# EAGLE design agrosavia_pcb (EAGLE 9.6.2)
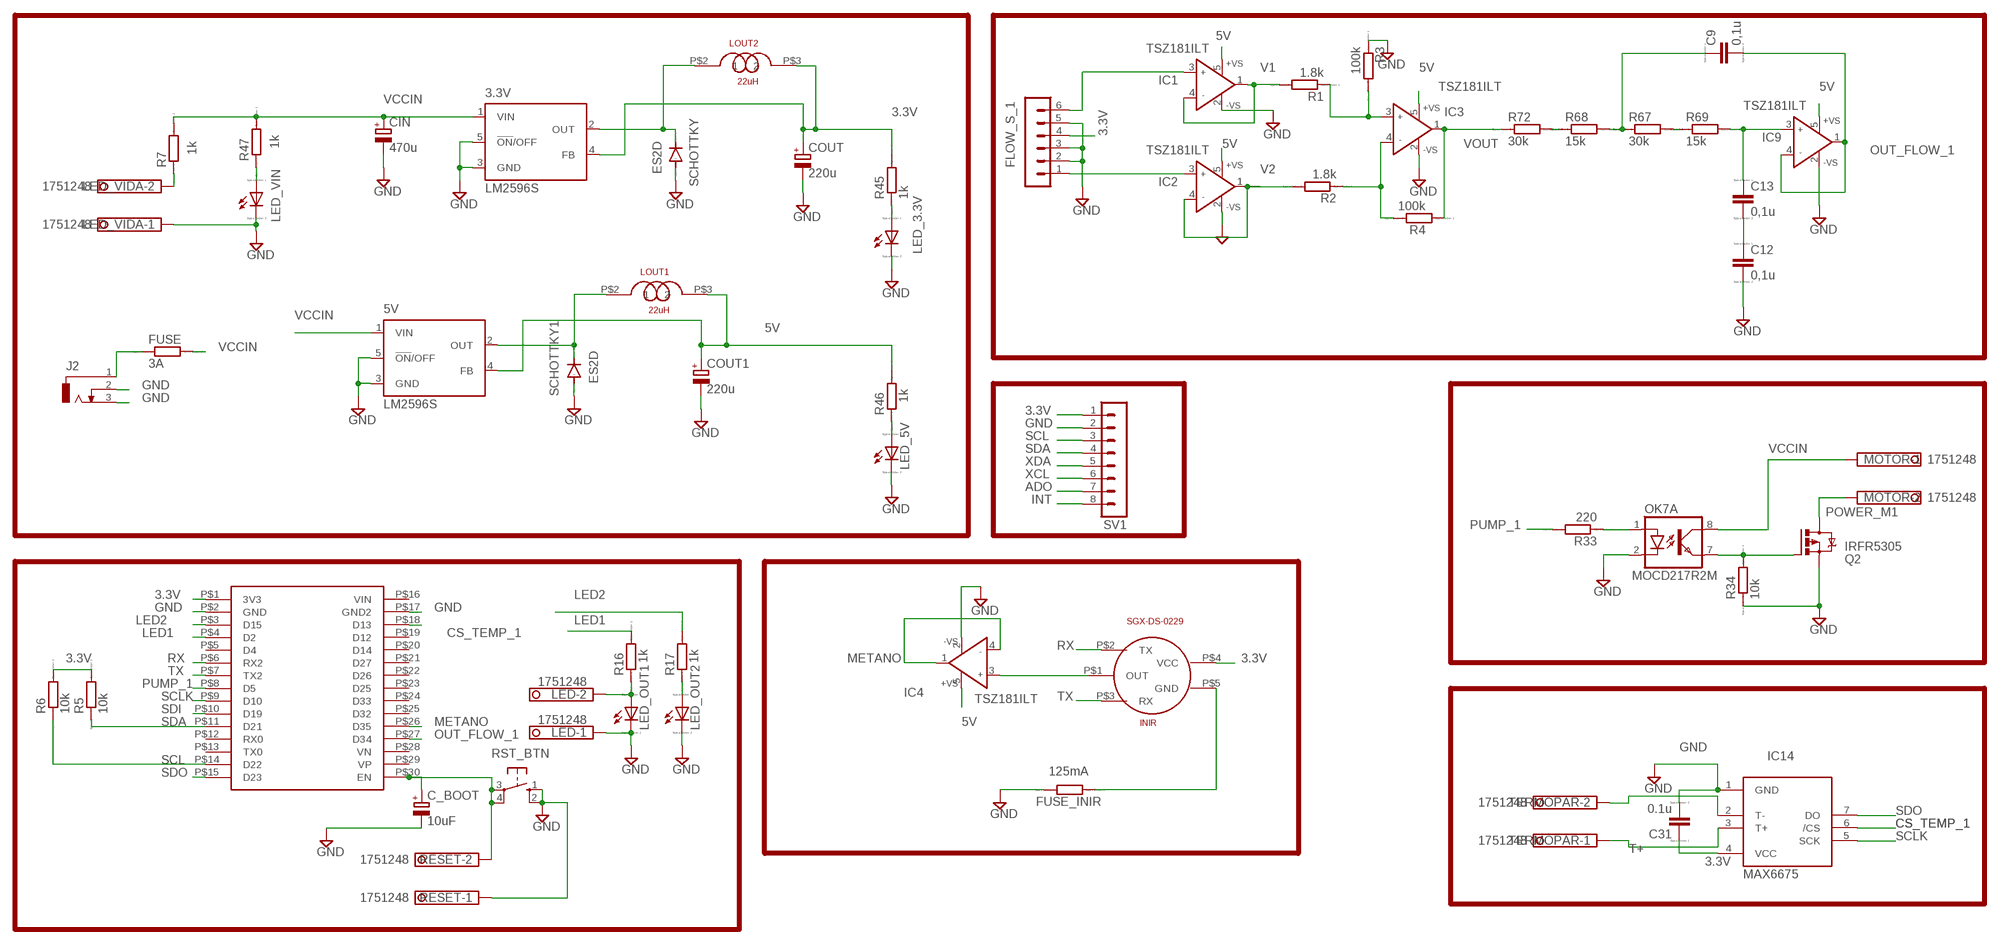
[diagram p0: schematic, sheet 1]

## Parts
3.3V  LM2596S  [TO263-5]
5V  LM2596S  [TO263-5]
C9  0,1u  C  [C0805]
C12  0,1u  C  [C0805]
C13  0,1u  C  [C0805]
C31  0.1u  C  [C0805]
C_BOOT  10uF  CPOL-EUSANYO_SMD_B6  [SANYO-OSCON_SMD_B6]
CIN  470u  CPOL-EUSANYO_SMD_F12  [SANYO-OSCON_SMD_F12]
COUT  220u  CPOL-EUUD-10X10  [UD-10X10_NICHICON]
COUT1  220u  CPOL-EUUD-10X10  [UD-10X10_NICHICON]
ESP32DEVKITV1  ESP32  [ESP32]
FLOW_S_1  MA06-1  [MA06-1]
FUSE  3A  RR1206  [R1206]
FUSE_INIR  125mA  RR0402  [R0402]
IC1  TSZ181ILT  AD8001RT  [SOT23-5]
IC2  TSZ181ILT  AD8001RT  [SOT23-5]
IC3  TSZ181ILT  AD8001RT  [SOT23-5]
IC4  TSZ181ILT  AD8001RT  [SOT23-5]
IC9  TSZ181ILT  AD8001RT  [SOT23-5]
IC14  MAX6675  [SO08]
J2  DCJ0303  [DCJ0303]
LED  1751248  [1751248]
LED_3.3V  LED_E  [LED_1206]
LED_5V  LED_E  [LED_1206]
LED_OUT1  LED_E  [LED_1206]
LED_OUT2  LED_E  [LED_1206]
LED_VIDA  1751248  [1751248]
LED_VIN  LED_E  [LED_1206]
LOUT1  22uH  SRP1038A  [SRP1038A]
LOUT2  22uH  SRP1038A  [SRP1038A]
MOTOR  1751248  [1751248]
OK7  MOCD217R2M  ILD205  [SOIC08]
Q2  IRFR5305  [D-PAK_TO252AA]
R1  1.8k  R  [R0805]
R2  1.8k  R  [R0805]
R3  100k  R  [R0805]
R4  100k  R  [R0805]
R5  10k  RR1206  [R1206]
R6  10k  RR1206  [R1206]
R7  1k  R  [R0805]
R16  1k  R  [R0805]
R17  1k  R  [R0805]
R33  220  RR0603  [R0603]
R34  10k  RR1206  [R1206]
R45  1k  R  [R0805]
R46  1k  R  [R0805]
R47  1k  R  [R0805]
R67  30k  R  [R0805]
R68  15k  R  [R0805]
R69  15k  R  [R0805]
R72  30k  R  [R0805]
RESET  1751248  [1751248]
RST_BTN  10-XX  [B3F-10XX]
SCHOTTKY  ES2D  [SMB]
SCHOTTKY1  ES2D  [SMB]
SGX-DS-0229  INIR  [INIR]
SV1  MA08-1  [MA08-1]
TERMOPAR  1751248  [1751248]

## Nets
3.3V: 3.3V.4(FB) C31.1 COUT.+ ESP32DEVKITV1.P$1(3V3) FLOW_S_1.4 IC14.4(VCC) LOUT2.P$3 R5.2 R6.2 R45.2 SGX-DS-0229.P$4(VCC) SV1.1
5V: 5V.4(FB) COUT1.+ IC1.5(+VS) IC2.5(+VS) IC3.5(+VS) IC4.5(+VS) IC9.5(+VS) LOUT1.P$3 R46.2
ADO: SV1.7
CS_TEMP_1: ESP32DEVKITV1.P$18(D13) IC14.6(/CS)
GND: 3.3V.3(GND) 3.3V.5(!ON!/OFF) 5V.3(GND) 5V.5(!ON!/OFF) C12.2 C31.2 C_BOOT.- CIN.- COUT1.- COUT.- ESP32DEVKITV1.P$2(GND) ESP32DEVKITV1.P$17(GND2) FLOW_S_1.2 FLOW_S_1.3 FLOW_S_1.5 FUSE_INIR.2 IC1.2(-VS) IC2.2(-VS) IC3.2(-VS) IC4.2(-VS) IC9.2(-VS) IC14.1(GND) J2.2 J2.3 LED.1 LED_3.3V.C LED_5V.C LED_OUT1.C LED_OUT2.C LED_VIDA.1 LED_VIN.C OK7.2(A:C) Q2.3(S) R3.1 R34.1 RESET.1 RST_BTN.1(S) RST_BTN.2(S1) SCHOTTKY1.A SCHOTTKY.A SV1.2
INT: SV1.8
LED1: ESP32DEVKITV1.P$4(D2) R16.2
LED2: ESP32DEVKITV1.P$3(D15) R17.2
METANO: ESP32DEVKITV1.P$26(D35) IC4.1(OUT) IC4.4(IN-)
N$1: FLOW_S_1.1 IC2.3(IN+)
N$2: FLOW_S_1.6 IC1.3(IN+)
N$4: IC3.3(IN+) R1.1 R3.2
N$5: IC3.4(IN-) R2.1 R4.2
N$6: FUSE_INIR.1 SGX-DS-0229.P$5(GND)
N$7: C_BOOT.+ ESP32DEVKITV1.P$30(EN) RESET.2 RST_BTN.3(P) RST_BTN.4(P1)
N$8: IC4.3(IN+) SGX-DS-0229.P$1(OUT)
N$9: LED_VIDA.2 R7.1
N$15: LED.2 LED_OUT1.A R16.1
N$16: LED_OUT2.A R17.1
N$33: OK7.1(A:A) R33.1
N$37: OK7.7(A:EMIT) Q2.1(G) R34.2
N$43: 3.3V.2(OUT) LOUT2.P$2 SCHOTTKY.C
N$44: 5V.2(OUT) LOUT1.P$2 SCHOTTKY1.C
N$48: LED_3.3V.A R45.1
N$49: LED_VIN.A R47.1
N$50: LED_5V.A R46.1
N$59: IC14.2(T-) TERMOPAR.2
N$63: FUSE.1 J2.1
N$74: R68.1 R72.2
N$75: C9.1 R67.1 R68.2
N$76: R67.2 R69.1
N$77: C13.1 IC9.3(IN+) R69.2
N$78: C12.1 C13.2
OUT_FLOW_1: C9.2 ESP32DEVKITV1.P$27(D34) IC9.1(OUT) IC9.4(IN-)
POWER_M1: MOTOR.2 Q2.4(D)
PUMP_1: ESP32DEVKITV1.P$8(D5) R33.2
RX: ESP32DEVKITV1.P$6(RX2) SGX-DS-0229.P$2(TX)
SCL: ESP32DEVKITV1.P$14(D22) R6.1 SV1.3
SCLK: ESP32DEVKITV1.P$9(D10) IC14.5(SCK)
SDA: ESP32DEVKITV1.P$11(D21) R5.1 SV1.4
SDI: ESP32DEVKITV1.P$10(D19)
SDO: ESP32DEVKITV1.P$15(D23) IC14.7(DO)
T+: IC14.3(T+) TERMOPAR.1
TX: ESP32DEVKITV1.P$7(TX2) SGX-DS-0229.P$3(RX)
V1: IC1.1(OUT) IC1.4(IN-) R1.2
V2: IC2.1(OUT) IC2.4(IN-) R2.2
VCCIN: 3.3V.1(VIN) 5V.1(VIN) CIN.+ FUSE.2 MOTOR.1 OK7.8(A:COL) R7.2 R47.2
VOUT: IC3.1(OUT) R4.1 R72.1
XCL: SV1.6
XDA: SV1.5
Unconnected: ESP32DEVKITV1.P$5(D4) ESP32DEVKITV1.P$12(RX0) ESP32DEVKITV1.P$13(TX0) ESP32DEVKITV1.P$16(VIN) ESP32DEVKITV1.P$19(D12) ESP32DEVKITV1.P$20(D14) ESP32DEVKITV1.P$21(D27) ESP32DEVKITV1.P$22(D26) ESP32DEVKITV1.P$23(D25) ESP32DEVKITV1.P$24(D33) ESP32DEVKITV1.P$25(D32) ESP32DEVKITV1.P$28(VN) ESP32DEVKITV1.P$29(VP) OK7.3(B:A) OK7.4(B:C) OK7.5(B:EMIT) OK7.6(B:COL)

## Library data of the parts
3.3V 5V = national-semiconductor:LM2596: SIMPLE SWITCHER® Power Converter 150 kHz 3A Step-Down Voltage Regulator Source: http://www.national.com/ds/LM/LM2596.pdf; MF: NATIONAL SEMICONDUCTOR; MPN: LM2596S-ADJ/NOPB; OC_FARNELL: 9494367; OC_NEWARK: 41K3842
C9 C12 C13 C31 = eagle-ltspice:C: CAPACITOR, European symbol; SPICEMODEL: NONE; SPICEPREFIX: C
C_BOOT CIN COUT COUT1 = rcl:CPOL-EU: POLARIZED CAPACITOR, European symbol; SPICEPREFIX: C
ESP32DEVKITV1 = ESP32:ESP32
FLOW_S_1 = con-lstb:MA06-1: PIN HEADER; OC_FARNELL: unknown; OC_NEWARK: unknown
FUSE FUSE_INIR R1-R7 R16 R17 R33 R34 R45-R47 R67-R69 R72 = eagle-ltspice:R: RESISTOR, European symbol; SPICEMODEL: NONE; SPICEPREFIX: R
IC1-IC4 IC9 = analog-devices:AD8001: 800 MHz, 50 mW Current Feedback Amplifier Source: http://www.analog.com/static/imported-files/data_sheets/AD8001.pdf; MF: ALTERA CORPORATION; MPN: AD8001ARTZ-REEL7; OC_FARNELL: 1651271; OC_NEWARK: 59K6136
IC14 = MAX6675:MAX6675; AVAILABILITY: Unavailable; DESCRIPTION: IC THERMOCOUP TO DGTL 8-SOIC; MF: Maxim Integrated; MP: MAX6675; PACKAGE: SOIC-8 Maxim Integrated; PRICE: None
J2 = con-jack:DCJ0303: DC POWER JACK Source: DCJ0303.pdf; OC_FARNELL: unknown; OC_NEWARK: unknown
LED LED_VIDA MOTOR RESET TERMOPAR = con-phoenix-350:1751248: MKDS 1/ 2-3,5 Printklemme Nennstrom: 10 A Bemessungsspannung: 160 V Raster: 3,5 mm Polzahl: 2 Montageart: Löten Anschlussart: Schraubanschluss Anschlussrichtung vom Leiter zur Platine: 0° Source: http://eshop.phoenixcontact.com .. 1751248.pdf; OC_FARNELL: unknown; OC_NEWARK: unknown
LED_3.3V LED_5V LED_OUT1 LED_OUT2 LED_VIN = eagle-ltspice:LED_E: LED Source: http://www.osram.convergy.de Source: www.luxeon.com Source: www.kingbright.com; SPICEMODEL: NONE; SPICEPREFIX: D; SPICETYPE: diode
LOUT1 LOUT2 = SRP1038A:SRP1038A
OK7 = optocoupler:ILD2*: Siemens ILD205/206/207/211/213/217 DUAL PHOTOTRANSISTOR SMALL OUTLINE SURFACE MOUNT OPTOCOUPLER Source: 153385-da-01-en-Optocoupler_ILD205-T.pdf; MF: VISHAY/TELEFUNKEN; MPN: ILD205T; OC_FARNELL: 1469512; OC_NEWARK: 20H8678
Q2 = transistor-power:IRF?5305: HEXFET Power MOSFET Source: http://www.irf.com/product-info/datasheets/data/irfr5305pbf.pdf
RST_BTN = switch-omron:10-XX: OMRON SWITCH; MPN: B3F-1000; OC_FARNELL: 176432; OC_NEWARK: 36M3542
SCHOTTKY SCHOTTKY1 = diode:ES2D: DIODE super fast rectifier, 2 A
SGX-DS-0229 = INIR:INIR
SV1 = con-lstb:MA08-1: PIN HEADER; OC_FARNELL: unknown; OC_NEWARK: unknown

## Board
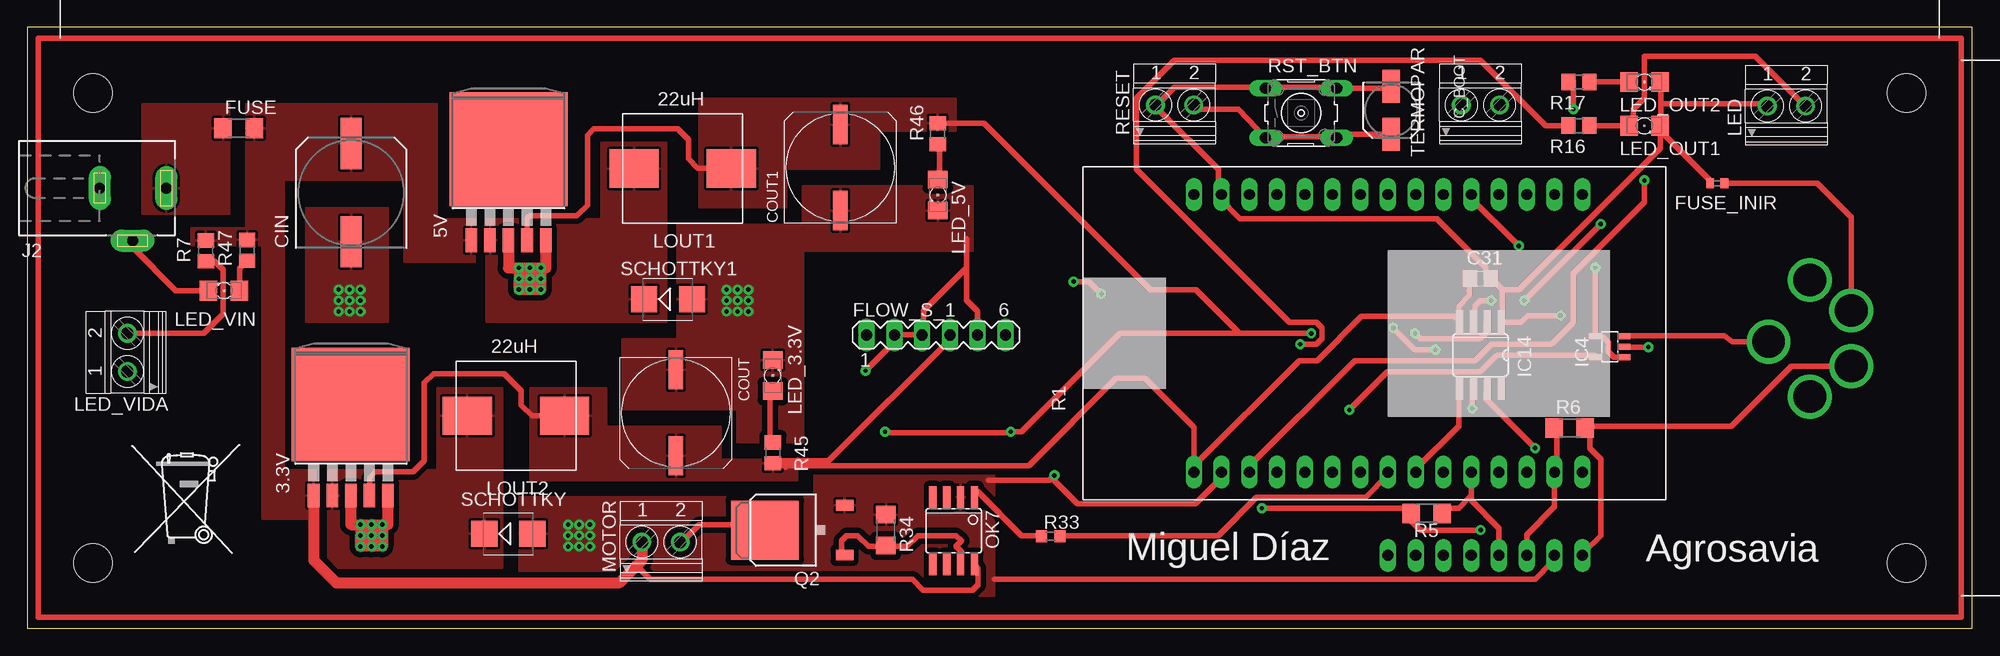
[diagram p1: board, top side]
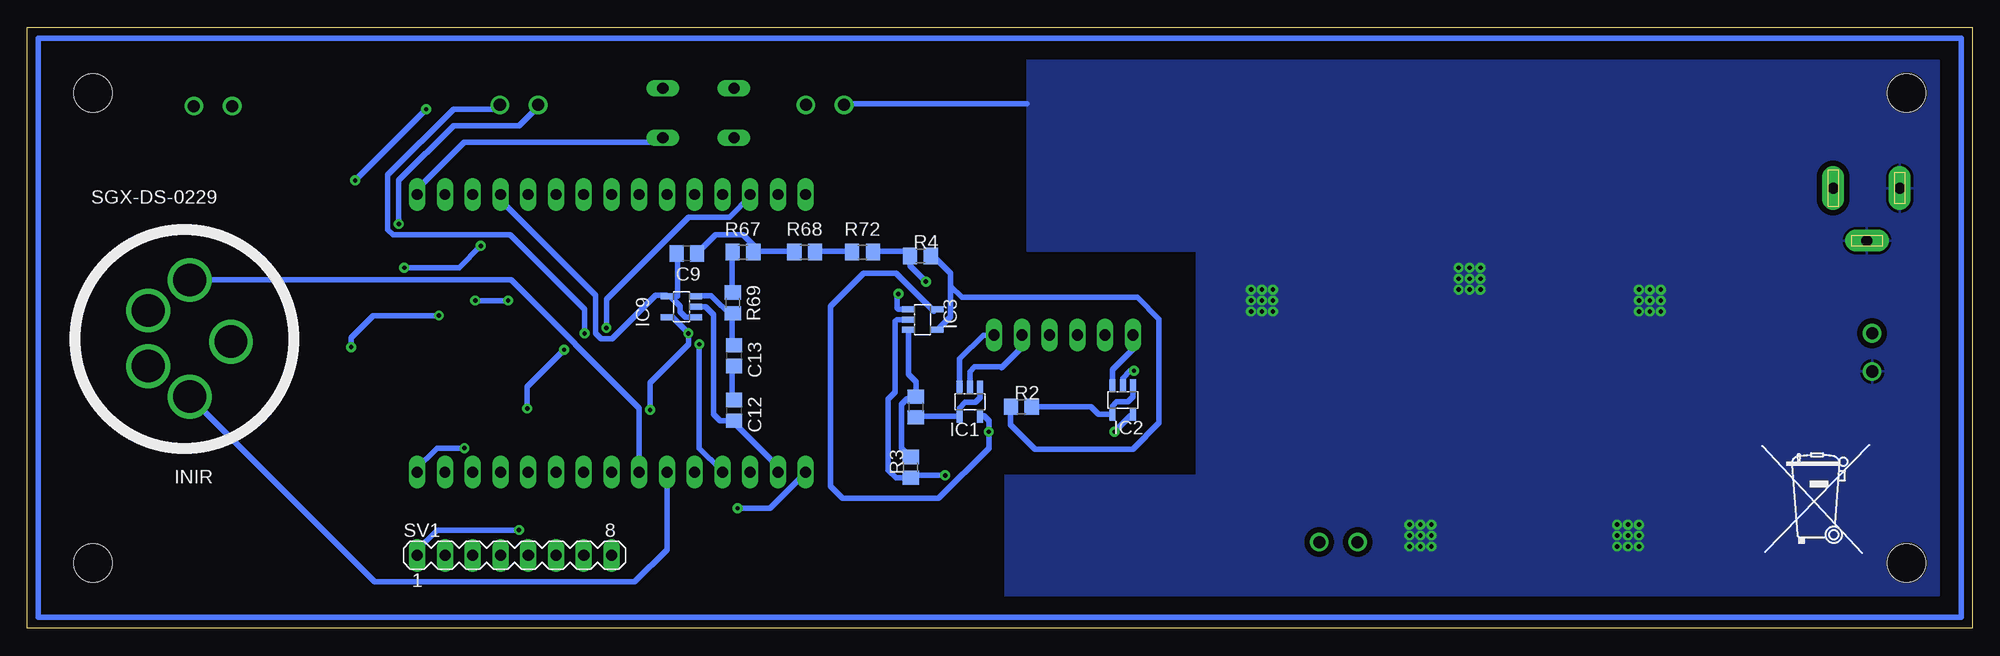
[diagram p2: board, bottom side, seen from below]

Size 178 x 55 mm. Coordinates in mm from the lower left corner, seen from the top.
Outline: 0,0 178,0 178,55 0,55 0,0
Copper layers (1*16): Top 0.035mm / dielectric 1.5mm / Bottom 0.035mm
Design rules "designrulesmicrocircuitos *": minimum track width 0.5mm, minimum drill 0.4mm, track to track 0.5mm, track to pad 0.3mm, pad to pad 0.3mm, via to via 0.3mm, smd to smd 4mil, copper to edge 5mil, drill to drill 6mil, minimum pad ring 0.25mm, minimum via ring 0.25mm, stop-mask expansion 4mil, vias tented up to drill 0mil, thermal gap 10mil
Holes 3.5 mm at 172,49 172,6 6,6 6,49

### Footprints (pad centres in the part's own frame; a part is rotated, then mirrored left to right if it is on the bottom)
TO263-5 = smd 1.067 x 2.159: 1 -3.404,-5.791; 2 -1.702,-5.791; 3 0,-5.791; 4 1.702,-5.791; 5 3.404,-5.791 | smd 10.8 x 10.41: 6 0,2.54
C0805 = smd 1.3 x 1.5: 1 -0.95,0; 2 0.95,0
SANYO-OSCON_SMD_B6 = smd 3 x 1.6: + 2.2,0; - -2.2,0
SANYO-OSCON_SMD_F12 = smd 4.7 x 1.9: + 4.5,0; - -4.5,0
UD-10X10_NICHICON = smd 3.6 x 1.3: + 3.925,0; - -3.95,0
ESP32 = drill 1 long: P$1 -12.7,15.24; P$2 -12.7,12.7; P$3 -12.7,10.16; P$4 -12.7,7.62; P$5 -12.7,5.08; P$6 -12.7,2.54; P$7 -12.7,0; P$8 -12.7,-2.54; P$9 -12.7,-5.08; P$10 -12.7,-7.62; P$11 -12.7,-10.16; P$12 -12.7,-12.7; P$13 -12.7,-15.24; P$14 -12.7,-17.78; P$15 -12.7,-20.32; P$16 12.7,15.24; P$17 12.7,12.7; P$18 12.7,10.16; P$19 12.7,7.62; P$20 12.7,5.08; P$21 12.7,2.54; P$22 12.7,0; P$23 12.7,-2.54; P$24 12.7,-5.08; P$25 12.7,-7.62; P$26 12.7,-10.16; P$27 12.7,-12.7; P$28 12.7,-15.24; P$29 12.7,-17.78; P$30 12.7,-20.32
MA06-1 = drill 1.016 long: 1 -6.35,0; 2 -3.81,0; 3 -1.27,0; 4 1.27,0; 5 3.81,0; 6 6.35,0
R1206 = smd 1.6 x 1.803: 1 -1.422,0; 2 1.422,0
R0402 = smd 0.7 x 0.9: 1 -0.65,0; 2 0.65,0
SOT23-5 = smd 0.55 x 1.2: 1 -0.95,-1.3; 2 0,-1.3; 3 0.95,-1.3; 4 0.95,1.3; 5 -0.95,1.3
SO08 = smd 0.66 x 2.032: 1 -1.905,-3.073; 2 -0.635,-3.073; 3 0.635,-3.073; 4 1.905,-3.073; 5 1.905,3.073; 6 0.635,3.073; 7 -0.635,3.073; 8 -1.905,3.073
DCJ0303 = drill 1 pad 2 long: 1 0,3.1; 2 4.8,0; 3 0,-3
1751248 = drill 1.1 pad 1.7: 1 -1.75,-0.1; 2 1.75,-0.1
LED_1206 = smd 1.6 x 1.803: A -1.422,0; C 1.422,0
SRP1038A = smd 4.5 x 3.5: P$2 4.45,0; P$3 -4.45,0
SOIC08 = smd 0.66 x 2.032: 1 -1.905,-3.073; 2 -0.635,-3.073; 3 0.635,-3.073; 4 1.905,-3.073; 5 1.905,3.073; 6 0.635,3.073; 7 -0.635,3.073; 8 -1.905,3.073
D-PAK_TO252AA = smd 1 x 1.6: 1 -2.28,-4.8; 3 2.28,-4.8 | smd 5.4 x 6.2: 4 0,2.5
R0805 = smd 1.3 x 1.5: 1 -0.95,0; 2 0.95,0
R0603 = smd 1 x 1.1: 1 -0.85,0; 2 0.85,0
B3F-10XX = drill 1.016 long: 1 -3.251,2.261; 2 3.251,2.261; 3 -3.251,-2.261; 4 3.251,-2.261
SMB = smd 2.4 x 2.4: A 2.2,0; C -2.2,0
INIR = drill 3 pad 4: P$1 4.24,0.254; P$2 0.46,5.289; P$3 0.46,-5.381; P$4 -3.34,2.494; P$5 -3.34,-2.586
MA08-1 = drill 1.016 long: 1 -8.89,0; 2 -6.35,0; 3 -3.81,0; 4 -1.27,0; 5 1.27,0; 6 3.81,0; 7 6.35,0; 8 8.89,0

### Placement (x,y rotation side)
3.3V  29.61,17.94 0 top
5V  44.04,41.31 0 top
C9  117.64,34.32 180 bottom
C12  113.32,19.95 270 bottom
C13  113.32,24.96 270 bottom
C31  133,32 0 top
C_BOOT  124.84,47.41 270 top
CIN  29.64,39.88 90 top
COUT  59.36,19.72 270 top
COUT1  74.41,42.17 90 top
ESP32DEVKITV1  122,27 90 top
FLOW_S_1  83.17,26.85 0 top
FUSE  19.34,45.76 0 top
FUSE_INIR  154.66,40.74 180 top
IC1  91.74,20.74 180 bottom
IC2  77.74,20.9 180 bottom
IC3  96.06,28.26 270 bottom
IC4  144.82,25.78 90 top
IC9  118.14,29.44 90 bottom
IC14  133,25 180 top
J2  9.63,40.29 270 top
LED  161,47.9 0 top
LED_3.3V  68.22,23.14 90 top
LED_5V  83.33,39.66 270 top
LED_OUT1  148,46 0 top
LED_OUT2  148,50 0 top
LED_VIDA  9.06,25.26 90 top
LED_VIN  18.01,30.9 180 top
LOUT1  59.98,42.08 180 top
LOUT2  44.73,19.45 180 top
MOTOR  58,8 0 top
OK7  84.78,8.94 180 top
Q2  70,9 90 top
R1  96.68,20.26 270 bottom
R2  87.02,20.29 0 bottom
R3  97.16,14.74 90 bottom
R4  96.26,34.08 0 bottom
R5  128.07,10.53 180 top
R6  141.17,18.33 0 top
R7  16.34,34.53 90 top
R16  142,46 180 top
R17  142,50 180 top
R33  93.66,8.44 0 top
R34  78.57,8.99 270 top
R45  68.24,16.06 270 top
R46  83.32,45.26 90 top
R47  20.12,34.6 90 top
R67  112.51,34.43 180 bottom
R68  106.86,34.43 180 bottom
R69  113.43,29.79 270 bottom
R72  101.56,34.43 180 bottom
RESET  105,48 0 top
RST_BTN  116.58,47.16 0 top
SCHOTTKY  44.03,8.66 0 top
SCHOTTKY1  58.64,30.12 0 top
SGX-DS-0229  163.6,26.5 180 top
SV1  133.42,6.69 0 bottom
TERMOPAR  133,48 0 top
U$3  [MUELLTONNE_10.00]  8.92,6.48 0 top
U$4  [MUELLTONNE_10.00]  19.89,6.48 0 bottom

### Tracks (layer width: path | path; a pad name or v marks a point on that pad's centre or on a via)
3.3V  (via drill 0.4)
  Top 0.5: 3.3V.4 31.31,13.79 31.85,14.33 35.33,14.33 36.33,15.32 36.33,22.46 37.19,23.32 43.64,23.32 45.22,21.75 45.22,20.42 46.19,19.45 LOUT2.P$3 | v133,9 127.51,9 126.65,9.86 R5.2 126.5,11 v113,11 | SV1.1 142.5,7 144,8.5 144,15.5 143,16.5 143,18 R6.2 143,18.5 155.96,18.5 161.46,24 166.5,24 SGX-DS-0229.P$4 | FLOW_S_1.4 84.53,26.75 84.53,26.51 73.35,15.32 70.5,15.32 | 68.67,15.32 70.5,15.32 | C31.1 132,32 132,30.5 131,29.5 131,28.5 IC14.4 130.61,28.56 122.11,28.56 118.06,24.51 116.41,24.51 106.76,14.86 ESP32DEVKITV1.P$1 | 106.72,14.33 ESP32DEVKITV1.P$1 | 69.38,14.9 91.65,14.9 99.63,22.87 102.29,22.87 106.76,18.41 ESP32DEVKITV1.P$1 | 69.38,14.9 68.75,14.9 | ESP32DEVKITV1.P$1 106.76,14.43 | 70.5,15.38 70.5,15.32 | 69.38,14.75 69.38,14.9
  Bottom 0.5: v133,9 140.5,9 142.5,7 SV1.1 | v113,11 110,11 107,14 ESP32DEVKITV1.P$1
  pour Top: 46,22 46,13.5 70.5,13.5 70.5,15.5 63.5,15.5 63.5,18.5 53,18.5 53,22
5V  (via drill 0.4)
  Top 0.5: 5V.4 45.74,37.54 45.98,37.77 50.3,37.77 51.26,38.74 51.26,45.11 51.84,45.7 59.52,45.7 60.51,44.71 60.51,42.95 61.34,42.12 63.91,42.12 | v78.5,18 78.6,17.9 89.9,17.9 v90,18 91,18 100,27 110.91,27 | 110.91,27 v117.5,27 | v121,20 124.5,23.5 133,23.5 134.5,25 143.5,25 IC4.5 | 110.91,27 106.95,30.96 102.79,30.96 87.55,46.21 R46.2
  Bottom 0.5: IC3.5 95,29 98.5,32.5 101.48,32.5 104.5,29.48 104.5,13 103.41,11.91 94.59,11.91 90,16.5 v90,18 90,19 90.44,19.44 IC1.5 | v78.5,18 77,19.5 IC2.5 | IC9.5 119,28.5 v117.5,27 117.5,26 121,22.5 v121,20
  pour Top: 61.5,44.5 61.5,48.5 85,48.5 85,45.5 78,45.5 78,42 69.5,42 69.5,38.5 61.5,38.5
CS_TEMP_1  (via drill 0.4)
  Top 0.5: v132.25,20.12 132.25,21.88 IC14.6 | v128.88,25.5 127,25.5 v125,27.5
  Bottom 0.5: v132.25,20.12 132.25,22.12 v128.88,25.5 | v125,27.5 125,30.12 117.5,37.62 113.75,37.62 111.75,39.62 ESP32DEVKITV1.P$18
GND  (via drill 0.4)
  Top 0.5: J2.2 9.63,34.87 13.6,30.9 LED_VIN.C | 135,31 134,32 C31.2 133.5,32 133.5,33 129,37.5 111,37.5 109,39.5 ESP32DEVKITV1.P$17 109,40 109,42 103.5,47.5 RESET.1 103.5,48 105,49.5 113.25,49.5 RST_BTN.1 | 135,31 135,28.5 IC14.1 134.99,27.99 136.71,27.99 137.34,28.63 v140.34,28.63 | 149.5,45.97 149.5,46 | 149.5,46 149.5,48 | 149.5,48 149.5,50 LED_OUT2.C | 149.5,46 LED_OUT1.C 149,46 149.44,45.55 | 135,31 136.5,31 149.44,43.95 149.44,45.55 | 113.42,49.5 RST_BTN.1 | FLOW_S_1.2 FLOW_S_1.3 82.01,26.85 82.01,29.06 85.94,32.99 | FLOW_S_1.2 79.5,27 79.5,26.36 v76.71,23.57 | FLOW_S_1.2 | 85.94,35.67 85.94,32.99 | 88.5,4.5 138,4.5 139.5,6 139.5,6.5 SV1.2 | 87.99,13.54 93.54,13.54 v94,14 94,13.49 96.1,11.39 106.89,11.39 109,13.5 109,14 ESP32DEVKITV1.P$2 | 85.94,32.99 85.97,33.02 85.97,30.04 86.97,29.03 FLOW_S_1.5 | IC4.2 146.17,25.73 v148.36,25.73 | C_BOOT.- 124.65,49.42 RST_BTN.2 119.75,49.5 113.62,49.5 RST_BTN.1 | 149.44,45.55 154,41 FUSE_INIR.2 | 149.5,48 159,48 LED.1
  Top 1: 5V.3 44.04,33 v45,33 | v45,33 v47,33 | v47,33 v47,31 v45,31 v45,32 | v45,32 v46,32 | 5V.5 47.44,33 v47,33 | v45,33 v45,32 | v46,33 v46,32 | v47,32 v46,32 | 3.3V.3 29.61,9.5 v30.5,9.5 | v32.5,9.5 33.01,9.5 3.3V.5 | v30.5,9.5 v31.5,9.5 | v31.5,9.5 v31.5,7.5 v30.5,7.5 | v31.5,9.5 v32.5,9.5 | v32.5,7.5 v30.5,7.5 | v30.5,7.5 v30.5,8.5 v32.5,8.5 v32.5,7.5 | v32.5,9.5 v32.5,7.5 | v30.5,9.5 v30.5,7.5
  Bottom 0.5: C12.2 113,18.5 109,14.5 ESP32DEVKITV1.P$2 | 97.5,14 R3.1 | v94,14 97,14 R3.1 | 86.5,48 103,48 RESET.1 | IC2.2 77.74,22.9 77.07,23.57 v76.71,23.57 | IC9.2 115.93,29.44 115.19,28.7 115.19,19.61 114.58,18.99 C12.2 | 113.15,18.82 C12.2 | IC1.2 91.74,23.5 91.32,23.93 88.9,23.93 88.83,23.85 86.97,25.7 FLOW_S_1.5 | v148.36,25.73 148.36,26.6 146.33,28.63 v140.34,28.63 | IC3.2 98.42,28.26 98.58,28.09 98.58,21.59 99.2,20.96 99.2,14.49 98.5,13.79 R3.1
  other vias: 30.5,29 30.5,30 29.5,30 28.5,30 28.5,29 29.5,29 28.5,31 29.5,31 30.5,31 46,31 31.5,8.5 66,29 66,30 65,30 64,30 64,29 65,29 64,31 65,31 66,31 51.5,7.5 51.5,8.5 50.5,8.5 49.5,8.5 49.5,7.5 50.5,7.5 49.5,9.5 50.5,9.5 51.5,9.5
  pour Bottom: 3,3 3,52 86.5,52 86.5,34.5 71,34.5 71,14 88.5,14 88.5,3
  pour Top: 25.5,38.5 33,38.5 33,28 25.5,28
  pour Top: 71,38.5 71,40.5 78.5,40.5 86.5,40.5 86.5,34.5 71.5,34.5 71,34.5 71,17 65,17 65,19.5 65,20 60,20 54.5,20 54.5,26.5 59.5,26.5 59.5,37 71,37
  pour Top: 45,12 45,3 88.5,3 88.5,14 72,14 72,12
LED1  (via drill 0.4)
  Top 0.5: v116.5,26 118,26 118.5,26.5 118.5,27.5 118,28 115.5,28 101.5,42 101.5,48.5 105,52 133,52 139,46 141,46 R16.2
  Bottom 0.5: v116.5,26 116.5,16.5 114.5,14.5 ESP32DEVKITV1.P$4
LED2  (via drill 0.4)
  Top 0.5: 141,50 R17.2 141.5,50 v141.5,47.5 | v148,41 148,39 141.5,32.5 141.5,28 139.5,26 134,26 132.5,24.5 121.5,24.5 111.5,14.5 ESP32DEVKITV1.P$3
  Bottom 0.5: v148,41 v141.5,47.5
METANO  (via drill 0.4)
  Top 0.5: IC4.1 145.2,24.83 144.71,25.33 144.71,26.19 144.17,26.73 IC4.4 143.5,27 v143.5,33 | v136.5,35 132,39.5 ESP32DEVKITV1.P$26
  Bottom 0.5: v143.5,33 138.5,33 v136.5,35
N$1
  Bottom 0.5: FLOW_S_1.1 76.81,25.53 78.69,23.65 IC2.3
N$2
  Bottom 0.5: IC1.3 92.69,24.66 90.51,26.85 FLOW_S_1.6
N$4
  Bottom 0.5: R3.2 97.5,16 98,16.5 98,20.5 97.5,21 97,21 R1.1 96.68,22.59 97.36,23.27 IC3.3
N$5
  Bottom 0.5: 93.5,31.32 93.5,32.5 95,34 R4.2 | 93.5,31.32 93.5,28.5 94.5,27.5 IC3.4 | R2.1 88,20.25 88,18.64 85.75,16.39 76.81,16.39 74.41,18.8 74.41,28.3 76.39,30.28 92.46,30.28 93.5,31.32
N$6
  Top 0.5: SGX-DS-0229.P$5 166.94,37.62 163.82,40.74 FUSE_INIR.1
N$7
  Top 0.5: 113.43,45 RST_BTN.3 | RESET.2 107,47.5 110.85,47.5 RST_BTN.3 | C_BOOT.+ 120.14,45.21 RST_BTN.4 119.74,45 113.62,45 RST_BTN.3
  Bottom 0.5: RST_BTN.4 120.25,44.5 138,44.5 142,40.5 142,40 142.25,39.75 ESP32DEVKITV1.P$30
N$8
  Top 0.5: IC4.3 146.18,26.77 155.31,26.77 156.06,26.25 SGX-DS-0229.P$1
N$9
  Top 0.5: LED_VIDA.2 16.14,27.01 17.94,28.81 17.94,32.82 17.17,33.59 R7.1
N$15
  Top 0.5: R16.1 LED_OUT1.A 147,46 147,47.5 148,48.5 148,52.35 158.15,52.35 162.5,48 LED.2
N$16
  Top 0.5: LED_OUT2.A R17.1
N$19
  Top 0.5: 1,54 177,54 177,1 1,1 1,54
N$20
  Bottom 0.5: 1,54 177,54 177,1 1,1 1,54
N$33
  Top 0.5: R33.1 92.5,8.5 91,8.5 87,12.5 OK7.1
N$37
  Top 0.5: OK7.7 85.5,6 85.5,7 85,7.5 85.5,8 85,8.5 81.5,8.5 80.5,7.5 79,7.5 R34.2 78.5,7.5 77,7.5 76,8.5 75,8.5 74.5,8 74.5,7 74.75,6.75 Q2.1
N$43
  pour Top: 27.5,14.5 37.5,14.5 37.5,22 43.5,22 43.5,5.5 27.5,5.5
N$44
  pour Top: 42,37.5 42,33.5 42,28 58,28 58.5,28 58.5,44.5 52.5,44.5 52.5,41.5 52.5,37.5
N$48
  Top 0.5: R45.1 68,17.5 68,21.5 LED_3.3V.A
N$49
  Top 0.5: 19.43,32.43 LED_VIN.A 19.43,32.95 R47.1
N$50
  Top 0.5: R46.1 83.5,44 83.5,41.5 LED_5V.A
N$59  (via drill 0.4)
  Top 0.5: v127,27 127.5,26.5 133,26.5 133.5,27 133.5,28 IC14.2
  Bottom 0.5: v127,27 127,29.18 133.82,36 144.5,36 145,36.5 145,41.5 139,47.5 135,47.5 TERMOPAR.2
N$63
  pour Top: 10.5,37.89 18.5,37.89 18.5,48 10.5,48
N$74
  Bottom 0.5: R72.2 103,34.5 105.5,34.5 R68.1
N$75
  Bottom 0.5: 111,34.5 111.5,34.5 R67.1 111,34.5 | 111,34.5 108,34.5 R68.2 | 111,34.5 112.5,36 115,36 116.5,34.5 C9.1
N$76
  Bottom 0.5: R69.1 113.5,31 113.5,34 R67.2
N$77
  Bottom 0.5: 113.49,28.54 115.4,30.45 116.66,30.45 IC9.3 | C13.1 113.5,26 113.5,28.5 113.49,28.54 | 113.49,28.54 R69.2
N$78
  Bottom 0.5: C12.1 113.5,21 113.5,24 C13.2
OUT_FLOW_1
  Bottom 0.5: C9.2 118.47,34.2 118.47,30.39 IC9.4 | 116.5,28.5 IC9.1 117.77,28.49 118.23,28.96 118.23,29.46 119.17,30.39 IC9.4 | IC9.4 119.5,30.5 120.5,30.5 124.5,26.5 125.5,26.5 126,27 126,30.5 135,39.5 ESP32DEVKITV1.P$27
POWER_M1
  Top 0.5: MOTOR.2 60,8 61.5,9.5 66.5,9.5 67,9 Q2.4
PUMP_1
  Top 0.5: R33.2 95,8.5 109,8.5 112.5,12 122.5,12 124.5,14 ESP32DEVKITV1.P$8
RX
  Bottom 0.5: SGX-DS-0229.P$2 146.2,4.27 122.41,4.27 119.46,7.21 ESP32DEVKITV1.P$6
SCL
  Top 0.5: SV1.3 137.23,8.57 139.78,11.13 ESP32DEVKITV1.P$14 140,14.5 140,18 R6.1
SCLK
  Top 0.5: IC14.5 131,21.5 131,18.5 127,14.5 ESP32DEVKITV1.P$9
SDA
  Top 0.5: ESP32DEVKITV1.P$11 132.16,12 | 132.16,12 132.16,11.71 134.69,9.19 SV1.4 | R5.1 129.5,11 131,11 132,12 132.16,12
SDO  (via drill 0.4)
  Top 0.5: v138,16.5 133.5,21 133.5,21.5 IC14.7
  Bottom 0.5: v138,16.5 140.5,16.5 142.5,14.5 ESP32DEVKITV1.P$15
T+  (via drill 0.4)
  Top 0.5: v134,30 133,30 132.5,29.5 132.5,28.5 IC14.3 | v144,37 v137,30
  Bottom 0.5: v137,30 v134,30 | v144,37 144,41 139,46 133,46 131.5,47.5 TERMOPAR.1
TX
  Bottom 0.5: SGX-DS-0229.P$3 133.74,31.88 122,20.15 ESP32DEVKITV1.P$7
V1
  Bottom 0.5: IC1.4 92.7,19.43 | R1.2 96.57,19.42 92.7,19.42 92.7,19.43 | IC1.1 90.79,21.1 91.21,20.68 92.18,20.68 92.7,20.16 92.7,19.43
V2
  Bottom 0.5: IC2.1 76.79,21.21 77.25,20.75 77.29,20.75 77.31,20.73 78.31,20.73 78.69,20.35 IC2.4 79.98,19.6 80.67,20.29 R2.2 | 85.76,20.05 R2.2 | 85.76,20.55 R2.2
VCCIN
  Top 0.5: 55.75,5.75 57,4.5 81,4.5 82,3.5 86.5,3.5 87,4 87,5.5 OK7.8
  Top 1: MOTOR.1 56.25,6.25 55.75,5.75 54.14,4.14 28.3,4.14 26.21,6.23 3.3V.1
  pour Top: 20,48 20,36.67 15,36.67 15,35 21.5,35 21.5,10 26.5,10 26.5,14.5 23.5,14.5 23.5,41 34.5,41 34.5,33.5 41,33.5 41,37.5 37.5,37.5 37.5,48
VOUT  (via drill 0.4)
  Top 0.5: v98.28,30.61 97.16,31.73 v95.76,31.73
  Bottom 0.5: R72.1 100.5,34.5 97.5,34.5 R4.1 97.21,33.18 v95.76,31.73 | IC3.1 98.27,29.21 98.4,29.34 98.4,30.48 v98.28,30.61

### Text on the board
tNames: Miguel Díaz | Agrosavia